# Altium schematic sheet TSAL.SchDoc
size 288 x 159 mm; Origin: Eagle
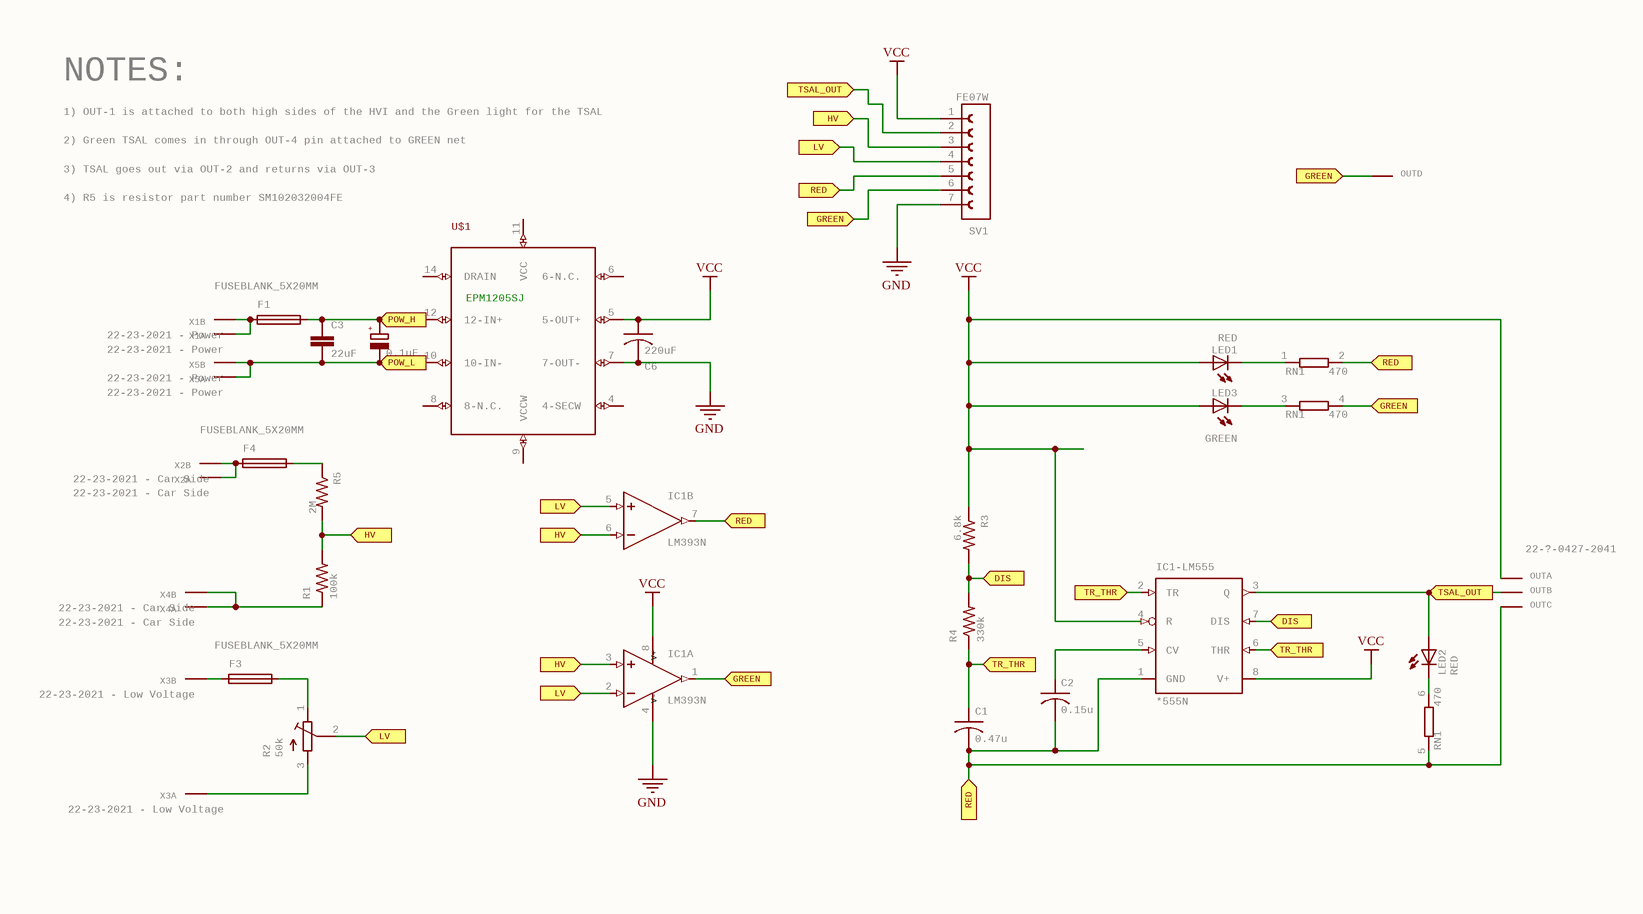
[diagram p0: TSAL.SchDoc]

## Parts
C1  0.47u  [C050-075X075]
C2  0.15u  [C050-075X075]
C3  22uF  [C150-091X182]
C5  0.1uF  [E7,5-16]
C6  220uF  [C050-055X075]
F1  FUSEBLANK_5X20MM  [FUSE_HOLDER_5X20MM]
F3  FUSEBLANK_5X20MM  [FUSE_HOLDER_5X20MM]
F4  FUSEBLANK_5X20MM  [FUSE_HOLDER_5X20MM]
IC1  LM393N  [DIL08]  (parts A,B,C of 3)
IC1-LM555  *555N  [DIL08]
LED1  RED  [LED3MM]
LED2  RED  [LED3MM]
LED3  GREEN  [LED3MM]
OUT  22-?-0427-2041  [6410-04]  (parts A,B,C,D of 4)
R1  100k  [0207/10]
R2  50k  [RTRIM3006P]
R3  6.8k  [0309/12]
R4  330k  [0309/12]
R5  2M  [0207/10]
RN1  470  PART: RN1  [SIL6]  (parts A,B,C of 3)
SV1  FE07W  [FE07W]
U$1  EPM1205SJ  [EPM1205SJ]  (value not drawn)
X1  22-23-2021 - Power  [22-23-2021]  (parts A,B of 2)
X2  22-23-2021 - Car Side  [22-23-2021]  (parts A,B of 2)
X3  22-23-2021 - Low Voltage  [22-23-2021]  (parts A,B of 2)
X4  22-23-2021 - Car Side  [22-23-2021]  (parts A,B of 2)
X5  22-23-2021 - Power  [22-23-2021]  (parts A,B of 2)

## Ports
DIS (in), GREEN (in), HV (in), LV (in), POW_H (in), POW_L (in), RED (in), TR_THR (in), TSAL_OUT (in)

## Nets
GND: C6.2 IC1.4(V-) SV1.7 U$1.7(7-OUT-)
VCC: C6.1 IC1.8(V+) IC1-LM555.4(R) IC1-LM555.8(V+) LED1.A LED3.A OUT.1(S) R3.1 SV1.1 U$1.5(5-OUT+)
DIS: IC1-LM555.7(DIS) R3.2 R4.2 ; port DIS
GREEN: IC1.1(OUT) OUT.4(S) RN1.4 SV1.6 ; port GREEN
HV: IC1.3(+IN) IC1.6(-IN) R1.2 R5.2 SV1.3 ; port HV
LV: IC1.2(-IN) IC1.5(+IN) R2.2(S) SV1.4 ; port LV
POW_H: C3.1 C5.+ F1.2 U$1.12(12-IN+) ; port POW_H
POW_L: C3.2 C5.- U$1.10(10-IN-) X5.1(S) X5.2(S) ; port POW_L
RED: C1.2 C2.2 IC1.7(OUT) IC1-LM555.1(GND) OUT.3(S) RN1.2 RN1.5 SV1.5 ; port RED
TR_THR: C1.1 IC1-LM555.2(TR) IC1-LM555.6(THR) R4.1 ; port TR_THR
TSAL_OUT: IC1-LM555.3(Q) LED2.A OUT.2(S) SV1.2 ; port TSAL_OUT
NetC2_1: C2.1 IC1-LM555.5(CV)
NetF1_1: F1.1 X1.1(S) X1.2(S)
NetF3_1: F3.1 X3.2(S)
NetF3_2: F3.2 R2.1(E)
NetF4_1: F4.1 X2.1(S) X2.2(S)
NetF4_2: F4.2 R5.1
NetLED1_K: LED1.K(C) RN1.1
NetLED2_K: LED2.K(C) RN1.6
NetLED3_K: LED3.K(C) RN1.3
NetR1_1: R1.1 X4.1(S) X4.2(S)
NetR2_3: R2.3(A) X3.1(S)

Not connected (* = marked no-connect by the designer): U$1 4(4-SECW) 6(6-N.C.) 8(8-N.C.) 9(VCCW) 11(VCC) 14(DRAIN)

## Notes on the sheet
- NOTES:
- 1) OUT-1 is attached to both high sides of the HVI and the Green light for the TSAL
- 2) Green TSAL comes in through OUT-4 pin attached to GREEN net
- 3) TSAL goes out via OUT-2 and returns via OUT-3
- 4) R5 is resistor part number SM102032004FE
- (near U$1) EPM1205SJ

## Library data of the parts
C1 C2 = C-US050-075X075: CAPACITOR, American symbol; GateName_1: G$1; SymbolName_1: C-US; DeviceName: 050-075X075; LibraryName: rcl; DeviceSetName: C-US; SPICEPREFIX: C
C3 = C-EU150-091X182: CAPACITOR, European symbol; GateName_1: G$1; SymbolName_1: C-EU; DeviceName: 150-091X182; LibraryName: rcl; DeviceSetName: C-EU; SPICEPREFIX: C
C5 = CPOL-EUE7.5-16: POLARIZED CAPACITOR, European symbol; GateName_1: G$1; SymbolName_1: CPOL; DeviceName: E7.5-16; LibraryName: rcl; DeviceSetName: CPOL-EU; +: +; SPICEPREFIX: C
C6 = C-US050-055X075: CAPACITOR, American symbol; GateName_1: G$1; SymbolName_1: C-US; DeviceName: 050-055X075; LibraryName: rcl; DeviceSetName: C-US; SPICEPREFIX: C
F1 F3 F4 = FUSEBLANK_5X20MM: Fuse; GateName_1: G$1; SymbolName_1: FUSE; DeviceName: BLANK_5X20MM; LibraryName: fuse; DeviceSetName: FUSE; MF: MF; MPN: MPN; OC_FARNELL: unknown; OC_NEWARK: unknown
IC1 = LM393N: COMPARATOR; GateName_1: A; SymbolName_1: OPAMP; GateName_2: B; GateName_3: P; SymbolName_3: PWR+-; DeviceName: N; DeviceSetName: LM393; SymbolName_2: OPAMP; LibraryName: linear
IC1-LM555 = *555N: TIMER; GateName_1: A; SymbolName_1: 555; DeviceName: N; DeviceSetName: *555; LibraryName: linear
LED1-LED3 = LED3MM: LED   OSRAM: - CHIPLED LG R971, LG N971, LY N971, LG Q971, LY Q971, LO R971, LY R971 LH N974, LH R974 LS Q976, LO Q976, LY Q976 LO Q996 - Hyper CHIPLED LW Q18S LB Q993, LB Q99A, LB R99A - SideLED LS A670, LO A670, LY A670, LG A670, LP A670 LB A673, LV A673, LT A673, LW A673 LH A674 LY A675 LS A676, LA A676, LO A676, LY A676, LW A676 LS A679, LY A679, LG A679 -  Hyper Micro SIDELEDÂ® LS Y876, LA Y876, LO Y876, LY Y876 LT Y87S - SmartLED LW L88C, LW L88S LB L89C, LB L89S, LG L890 LS L89K, LO L89K, LY L89K LS L896, LA L896, LO L896, LY L896 - TOPLED LS T670, LO T670, LY T670, LG T670, LP T670 LSG T670, LSP T670, LSY T670, LOP T670, LYG T670 LG T671, LOG T671, LSG T671 LB T673, LV T673, LT T673, LW T673 LH T674 LS T676, LA T676, LO T676, LY T676, LB T676, LH T676, LSB T676, LW T676 LB T67C, LV T67C, LT T67C, LS T67K, LO T67K, LY T67K, LW E67C LS E67B, LA E67B, LO E67B, LY E67B, LB E67C, LV E67C, LT E67C LW T67C LS T679, LY T679, LG T679 LS T770, LO T770, LY T770, LG T770, LP T770 LB T773, LV T773, LT T773, LW T773 LH T774 LS E675, LA E675, LY E675, LS T675 LS T776, LA T776, LO T776, LY T776, LB T776 LHGB T686 LT T68C, LB T68C - Hyper Mini TOPLEDÂ® LB M676 - Mini TOPLED SantanaÂ® LG M470 LS M47K, LO M47K, LY M47K    Source: http://www.osram.convergy.de   LUXEON: - LUMILEDÂ® LXK2-PW12-R00, LXK2-PW12-S00, LXK2-PW14-U00, LXK2-PW14-V00 LXK2-PM12-R00, LXK2-PM12-S00, LXK2-PM14-U00 LXK2-PE12-Q00, LXK2-PE12-R00, LXK2-PE12-S00, LXK2-PE14-T00, LXK2-PE14-U00 LXK2-PB12-K00, LXK2-PB12-L00, LXK2-PB12-M00, LXK2-PB14-N00, LXK2-PB14-P00, LXK2-PB14-Q00 LXK2-PR12-L00, LXK2-PR12-M00, LXK2-PR14-Q00, LXK2-PR14-R00 LXK2-PD12-Q00, LXK2-PD12-R00, LXK2-PD12-S00 LXK2-PH12-R00, LXK2-PH12-S00 LXK2-PL12-P00, LXK2-PL12-Q00, LXK2-PL12-R00    Source: www.luxeon.com   KINGBRIGHT:   KA-3528ASYC Source: www.kingbright.com; GateName_1: G$1; DeviceName: 3MM; SymbolName_1: LED; LibraryName: led; DeviceSetName: LED
OUT = 22-?-0427-2041: CONNECTOR   wire to board 2.54 mm (.1 inch) pitch header; GateName_1: -1; SymbolName_1: MV; GateName_2: -2; SymbolName_2: M; GateName_3: -3; GateName_4: -4; MF: MOLEX; SymbolName_3: M; SymbolName_4: M; DeviceName: 27-2041; LibraryName: con-molex; DeviceSetName: 22-?-04; MPN: MPN; OC_FARNELL: unknown; OC_NEWARK: unknown
R1 R5 = R-US_0207/10: RESISTOR, American symbol; GateName_1: G$1; SymbolName_1: R-US; DeviceSetName: R-US_; DeviceName: 0207/10; LibraryName: resistor
R2 = R-TRIMM3006P: Trimm resistor; GateName_1: G$1; SymbolName_1: R-TRIM-1; DeviceName: 3006P; LibraryName: resistor; DeviceSetName: R-TRIMM
R3 R4 = R-US_0309/12: RESISTOR, American symbol; GateName_1: G$1; SymbolName_1: R-US; DeviceSetName: R-US_; DeviceName: 0309/12; LibraryName: resistor
RN1 = E3RP: SIL RESISTOR; GateName_1: A; SymbolName_1: RPV; GateName_2: B; GateName_3: C; SymbolName_2: RPV; SymbolName_3: RPV; LibraryName: resistor-sil; DeviceSetName: E3RP; MF: MF; MPN: MPN; OC_FARNELL: unknown; OC_NEWARK: unknown
SV1 = FE07W: FEMALE HEADER; GateName_1: G$1; SymbolName_1: FE07-1; LibraryName: con-lsta; DeviceSetName: FE07W; MF: MF; MPN: MPN; OC_FARNELL: unknown; OC_NEWARK: unknown
U$1 = EPM1205SJ: GateName_1: G$1; SymbolName_1: EPM1205SJ; LibraryName: DC-DC Converter; DeviceSetName: EPM1205SJ
X1-X5 = 22-23-2021: .100" (2.54mm) Center Header - 2 Pin; GateName_1: -1; SymbolName_1: MV; GateName_2: -2; SymbolName_2: M; MF: MOLEX; LibraryName: con-molex; DeviceSetName: 22-23-2021; MPN: 22-23-2021; OC_FARNELL: 1462926; OC_NEWARK: 25C3832